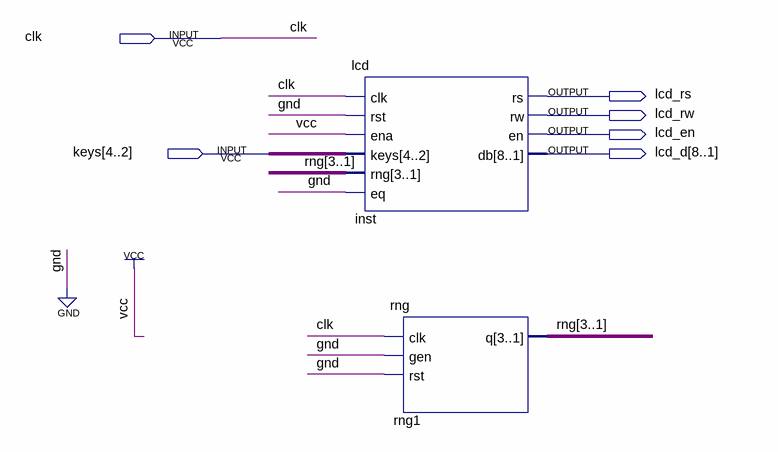
[diagram p0: schematic sheet]
// Quartus schematic test_lcd.bdf as structural Verilog: 2 symbols, 6 pins
module test_lcd (
  input  clk,
  input  [4:2] keys,
  output lcd_rs,
  output lcd_rw,
  output lcd_en,
  output [8:1] lcd_d
);

  wire [3:1] rng;

  lcd inst (
    .clk(clk), .rst(1'b0), .ena(1'b1), .keys(keys), .rng(rng), .eq(1'b0), .rs(lcd_rs), .rw(lcd_rw),
    .en(lcd_en), .db(lcd_d));
  rng rng1 (.clk(clk), .gen(1'b0), .rst(1'b0), .q(rng));
endmodule
